# Altium schematic sheet betaV2.0.SchDoc
size A3; Organization: Altium Limited; Address1: L3, 12a Rodborough Rd; Address2: Frenchs Forest; Address3: NSW; Address4: Australia 2086
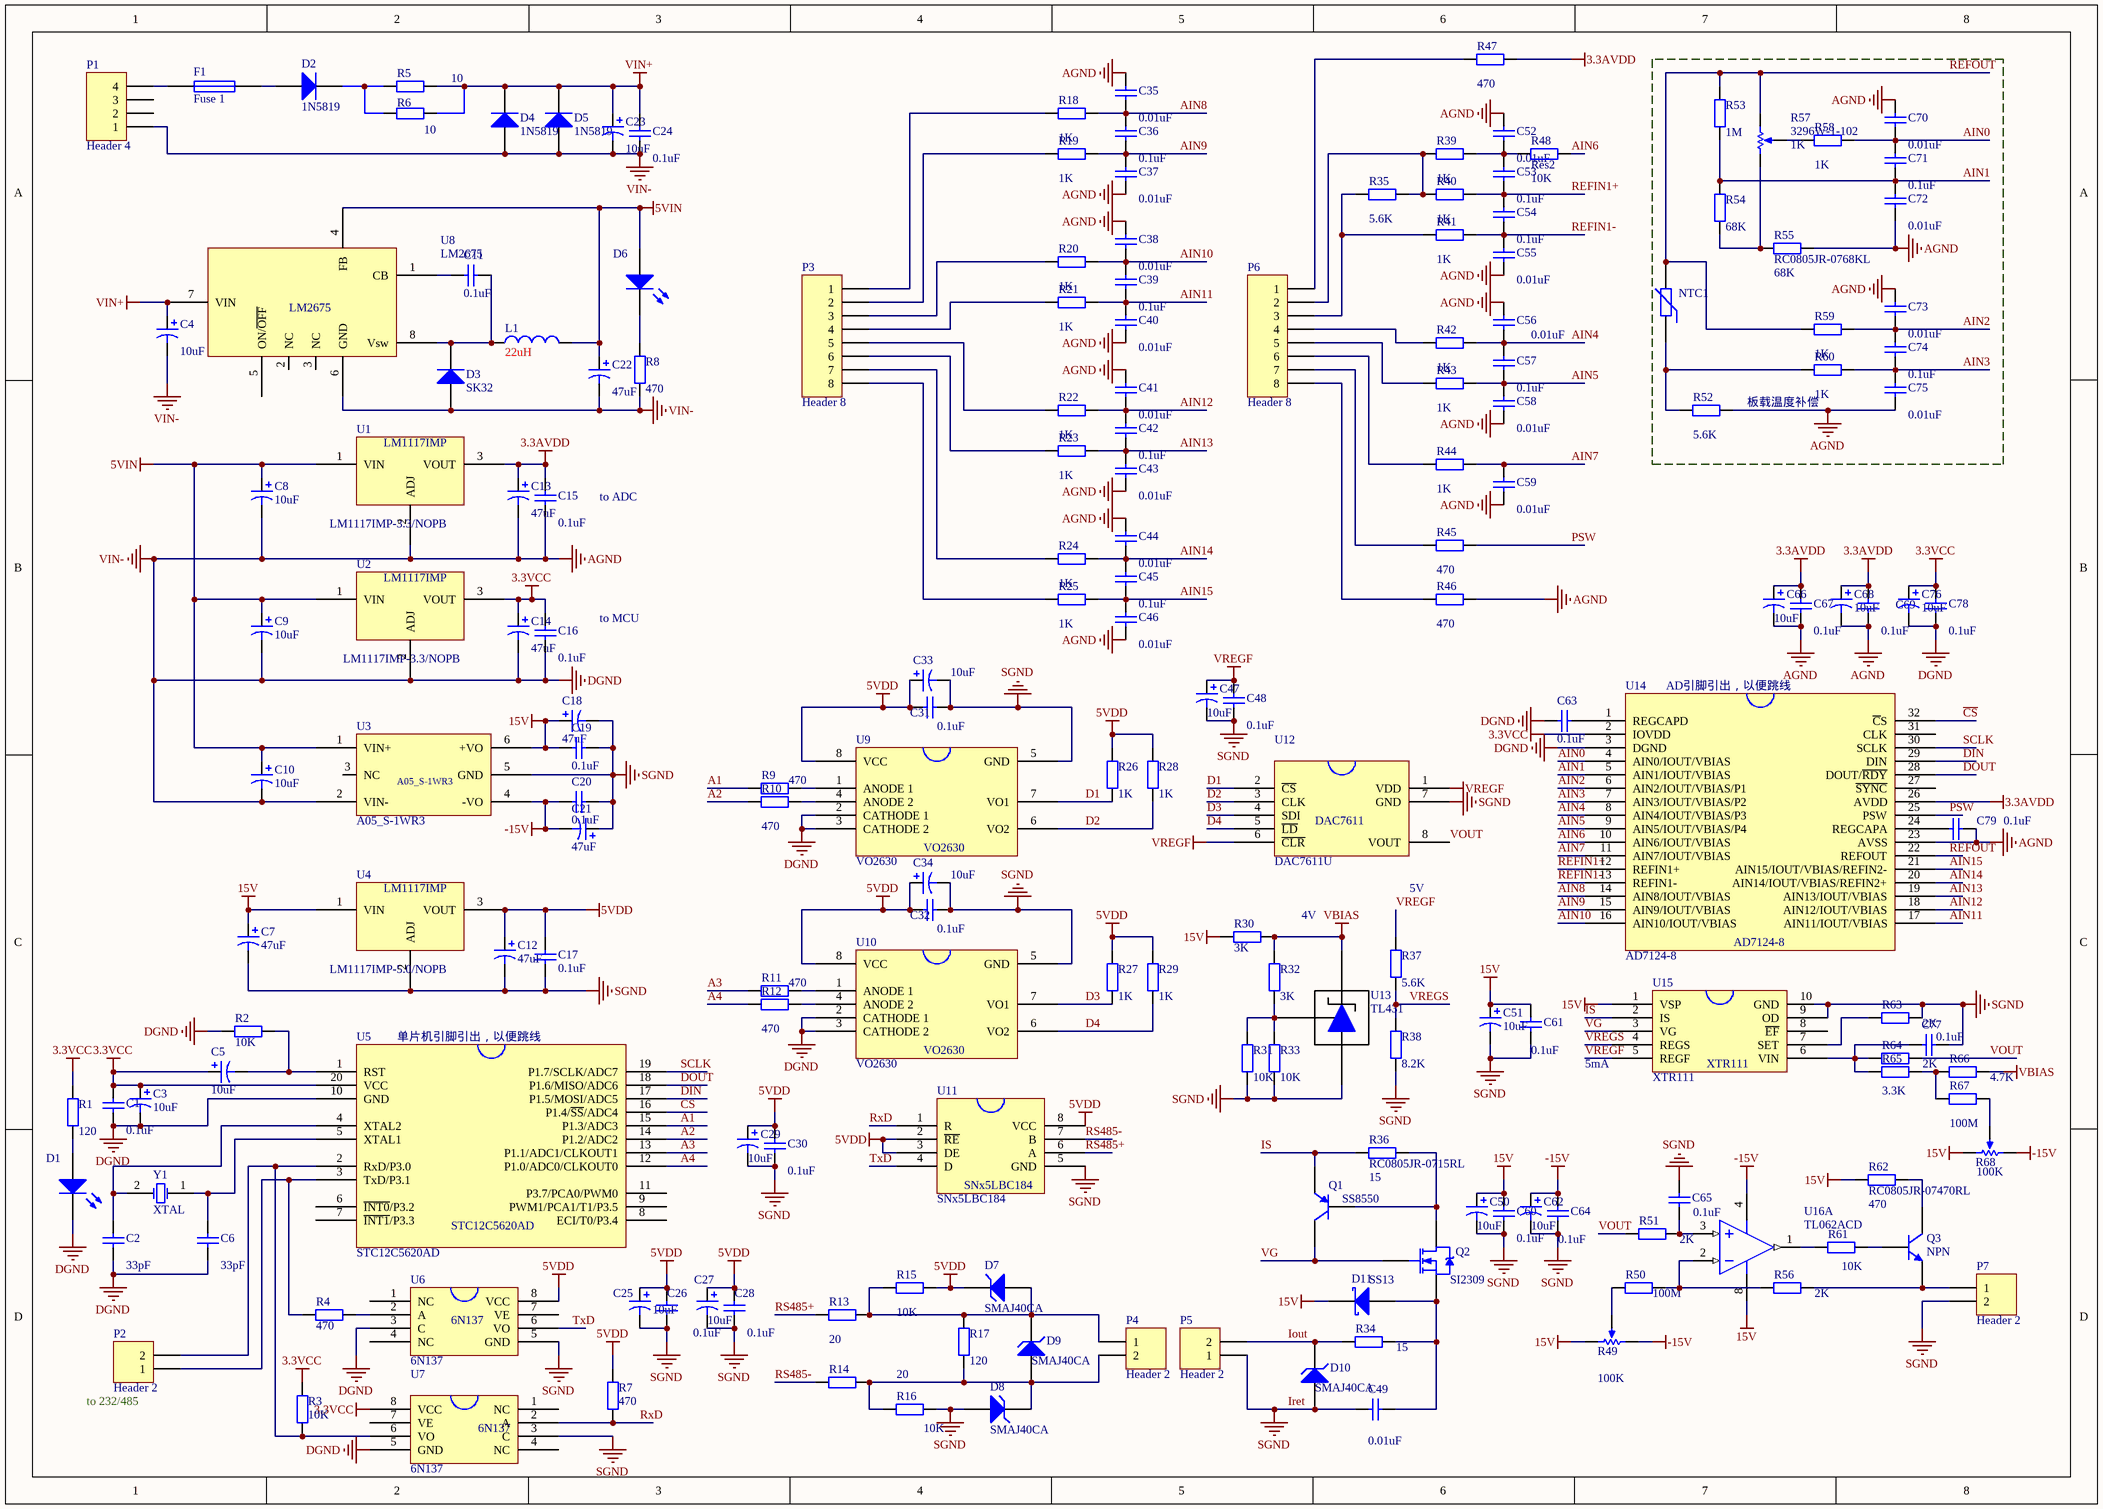
[diagram p0: betaV2.0.SchDoc]

## Parts
C1  value 0.1uF  [0805c]  (hidden comment: CC0805MRX7R9BB104)
C2  value 33pF  [0805c]  (hidden comment: CC0805MRX7R9BB330)
C3  value 10uF  [CB]  (hidden comment: T494B106M010AHAUTO)
C4  value 10uF  [Φ6.3×11.5]  (hidden comment: ECR1VNP100M1V050011)
C5  value 10uF  [CB]  (hidden comment: T494B106M010AHAUTO)
C6  value 33pF  [0805c]  (hidden comment: CC0805MRX7R9BB330)
C7  value 47uF  [CB]  (hidden comment: T494B476K025ATAUTO)
C8  value 10uF  [CB]  (hidden comment: T494B106M010AHAUTO)
C9  value 10uF  [CB]  (hidden comment: T494B106M010AHAUTO)
C10  value 10uF  [CB]  (hidden comment: T494B106M010AHAUTO)
C11  value 0.1uF  [0805c]  (hidden comment: CC0805MRX7R9BB104)
C12  value 47uF  [CB]  (hidden comment: T494B476M010AHAUTO)
C13  value 47uF  [CB]  (hidden comment: T494B476M010AHAUTO)
C14  value 47uF  [CB]  (hidden comment: T494B476M010AHAUTO)
C15  value 0.1uF  [0805c]  (hidden comment: CC0805MRX7R9BB104)
C16  value 0.1uF  [0805c]  (hidden comment: CC0805MRX7R9BB104)
C17  value 0.1uF  [0805c]  (hidden comment: CC0805MRX7R9BB104)
C18  value 47uF  [CB]  (hidden comment: T494B476K025ATAUTO)
C19  value 0.1uF  [0805c]  (hidden comment: CC0805MRX7R9BB104)
C20  value 0.1uF  [0805c]  (hidden comment: CC0805MRX7R9BB104)
C21  value 47uF  [CB]  (hidden comment: T494B476K025ATAUTO)
C22  value 47uF  [CB]  (hidden comment: T494B476M010AHAUTO)
C23  value 10uF  [Φ6.3×11.5]  (hidden comment: ECR1VNP100M1V050011)
C24  value 0.1uF  [0805c]  (hidden comment: CC0805MRX7R9BB104)
C25  value 10uF  [CB]  (hidden comment: T494B106M010AHAUTO)
C26  value 0.1uF  [0805c]  (hidden comment: CC0805MRX7R9BB104)
C27  value 10uF  [CB]  (hidden comment: T494B106M010AHAUTO)
C28  value 0.1uF  [0805c]  (hidden comment: CC0805MRX7R9BB104)
C29  value 10uF  [CB]  (hidden comment: T494B106M010AHAUTO)
C30  value 0.1uF  [0805c]  (hidden comment: CC0805MRX7R9BB104)
C31  value 0.1uF  [0805c]  (hidden comment: CC0805MRX7R9BB104)
C32  value 0.1uF  [0805c]  (hidden comment: CC0805MRX7R9BB104)
C33  value 10uF  [CB]  (hidden comment: T494B106M010AHAUTO)
C34  value 10uF  [CB]  (hidden comment: T494B106M010AHAUTO)
C35  value 0.01uF  [0805c]  (hidden comment: CC0805MRX7R9BB103)
C36  value 0.1uF  [0805c]  (hidden comment: CC0805MRX7R9BB104)
C37  value 0.01uF  [0805c]  (hidden comment: CC0805MRX7R9BB103)
C38  value 0.01uF  [0805c]  (hidden comment: CC0805MRX7R9BB103)
C39  value 0.1uF  [0805c]  (hidden comment: CC0805MRX7R9BB104)
C40  value 0.01uF  [0805c]  (hidden comment: CC0805MRX7R9BB103)
C41  value 0.01uF  [0805c]  (hidden comment: CC0805MRX7R9BB103)
C42  value 0.1uF  [0805c]  (hidden comment: CC0805MRX7R9BB104)
C43  value 0.01uF  [0805c]  (hidden comment: CC0805MRX7R9BB103)
C44  value 0.01uF  [0805c]  (hidden comment: CC0805MRX7R9BB103)
C45  value 0.1uF  [0805c]  (hidden comment: CC0805MRX7R9BB104)
C46  value 0.01uF  [0805c]  (hidden comment: CC0805MRX7R9BB103)
C47  value 10uF  [CB]  (hidden comment: T494B106M010AHAUTO)
C48  value 0.1uF  [0805c]  (hidden comment: CC0805MRX7R9BB104)
C49  value 0.01uF  [0805c]  (hidden comment: CC0805MRX7R9BB103)
C50  value 10uF  [CB]  (hidden comment: T494B106M025AHAUTO)
C51  value 10uF  [CB]  (hidden comment: T494B106M025AHAUTO)
C52  value 0.01uF  [0805c]  (hidden comment: CC0805MRX7R9BB103)
C53  value 0.1uF  [0805c]  (hidden comment: CC0805MRX7R9BB104)
C54  value 0.1uF  [0805c]  (hidden comment: CC0805MRX7R9BB104)
C55  value 0.01uF  [0805c]  (hidden comment: CC0805MRX7R9BB103)
C56  value 0.01uF  [0805c]  (hidden comment: CC0805MRX7R9BB103)
C57  value 0.1uF  [0805c]  (hidden comment: CC0805MRX7R9BB104)
C58  value 0.01uF  [0805c]  (hidden comment: CC0805MRX7R9BB103)
C59  value 0.01uF  [0805c]  (hidden comment: CC0805MRX7R9BB103)
C60  value 0.1uF  [0805c]  (hidden comment: CC0805MRX7R9BB104)
C61  value 0.1uF  [0805c]  (hidden comment: CC0805MRX7R9BB104)
C62  value 10uF  [CB]  (hidden comment: T494B106M025AHAUTO)
C63  value 0.1uF  [0805c]  (hidden comment: CC0805MRX7R9BB104)
C64  value 0.1uF  [0805c]  (hidden comment: CC0805MRX7R9BB104)
C65  value 0.1uF  [0805c]  (hidden comment: CC0805MRX7R9BB104)
C66  value 10uF  [CB]  (hidden comment: T494B106M010AHAUTO)
C67  value 0.1uF  [0805c]  (hidden comment: CC0805MRX7R9BB104)
C68  value 10uF  [CB]  (hidden comment: T494B106M010AHAUTO)
C69  value 0.1uF  [0805c]  (hidden comment: CC0805MRX7R9BB104)
C70  value 0.01uF  [0805c]  (hidden comment: CC0805MRX7R9BB103)
C71  value 0.1uF  [0805c]  (hidden comment: CC0805MRX7R9BB104)
C72  value 0.01uF  [0805c]  (hidden comment: CC0805MRX7R9BB103)
C73  value 0.01uF  [0805c]  (hidden comment: CC0805MRX7R9BB103)
C74  value 0.1uF  [0805c]  (hidden comment: CC0805MRX7R9BB104)
C75  value 0.01uF  [0805c]  (hidden comment: CC0805MRX7R9BB103)
C76  value 10uF  [CB]  (hidden comment: T494B106M010AHAUTO)
C77  value 0.1uF  [0805c]  (hidden comment: CC0805MRX7R9BB104)
C78  value 0.1uF  [0805c]  (hidden comment: CC0805MRX7R9BB104)
C79  value 0.1uF  [0805c]  (hidden comment: CC0805MRX7R9BB104)
D1  150080GS75000  [6-0805_N]  (value not drawn)
D2  1N5819  [SMC]
D3  SK32  [SMC]
D4  1N5819  [SMC]
D5  1N5819  [SMC]
D6  150080GS75000  [LEDΦ3.0]  (value not drawn)
D7  SMAJ40CA  [SMB]
D8  SMAJ40CA  [SMB]
D9  SMAJ40CA  [SMB]
D10  SMAJ40CA  [SMB]
D11  SS13  [SMB]
F1  Fuse 1  [6-0805_L]
L1  value 22uH  [vls4012]  (hidden comment: VLS4012HBX-220M)
NTC1  NTCS0805E3103JHT  [6-0805_N]  (value not drawn)
P1  Header 4  [HDR1X4]
P2  Header 2  [HDR1X2]
P3  Header 8  [HDR1X8]
P4  Header 2  [HDR1X2]
P5  Header 2  [HDR1X2]
P6  Header 8  [HDR1X8]
P7  Header 2  [HDR1X2]
Q1  SS8550  [SOT-23-BJT]
Q2  SI2309  [SOT-23-MOS]
Q3  NPN  [SOT-23-BJT]
R1  value 120  [0805R]  (hidden comment: RC0805JR-07120RL)
R2  value 10K  [0805R]  (hidden comment: RC0805JR-0710KL)
R3  value 10K  [0805R]  (hidden comment: RC0805JR-0710KRL)
R4  value 470  [0805R]  (hidden comment: RC0805JR-07470RL)
R5  value 10  [0805R]  (hidden comment: PNP-200KJBJ26-10R)
R6  value 10  [0805R]  (hidden comment: PNP-200KJBJ26-10R)
R7  value 470  [0805R]  (hidden comment: RC0805JR-07470RL)
R8  value 470  [0805R]  (hidden comment: RC0805JR-07470RL)
R9  value 470  [0805R]  (hidden comment: RC0805JR-07470RL)
R10  value 470  [0805R]  (hidden comment: RC0805JR-07470RL)
R11  value 470  [0805R]  (hidden comment: RC0805JR-07470RL)
R12  value 470  [0805R]  (hidden comment: RC0805JR-07470RL)
R13  value 20  [0805R]  (hidden comment: RC0805JR-0720RL)
R14  value 20  [0805R]  (hidden comment: RC0805JR-0720RL)
R15  value 10K  [0805R]  (hidden comment: RC0805JR-0710KL)
R16  value 10K  [0805R]  (hidden comment: RC0805JR-0710KL)
R17  value 120  [0805R]  (hidden comment: RC0805JR-07120RL)
R18  value 1K  [0805R]  (hidden comment: RC0805JR-071KL)
R19  value 1K  [0805R]  (hidden comment: RC0805JR-071KL)
R20  value 1K  [0805R]  (hidden comment: RC0805JR-071KL)
R21  value 1K  [0805R]  (hidden comment: RC0805JR-071KL)
R22  value 1K  [0805R]  (hidden comment: RC0805JR-071KL)
R23  value 1K  [0805R]  (hidden comment: RC0805JR-071KL)
R24  value 1K  [0805R]  (hidden comment: RC0805JR-071KL)
R25  value 1K  [0805R]  (hidden comment: RC0805JR-071KL)
R26  value 1K  [0805R]  (hidden comment: RC0805JR-071KL)
R27  value 1K  [0805R]  (hidden comment: RC0805JR-071KL)
R28  value 1K  [0805R]  (hidden comment: RC0805JR-071KL)
R29  value 1K  [0805R]  (hidden comment: RC0805JR-071KL)
R30  value 3K  [0805R]  (hidden comment: RC0805JR-073KL)
R31  value 10K  [0805R]  (hidden comment: RC0805JR-0710KL)
R32  value 3K  [0805R]  (hidden comment: RC0805JR-073KL)
R33  value 10K  [0805R]  (hidden comment: RC0805JR-0710KL)
R34  value 15  [0805R]  (hidden comment: RC0805JR-0715RL)
R35  value 5.6K  [0805R]  (hidden comment: RC0805JR-075600RL)
R36  RC0805JR-0715RL  value 15  [0805R]
R37  value 5.6K  [0805R]  (hidden comment: RC0805JR-075600RL)
R38  value 8.2K  [0805R]  (hidden comment: RC0805JR-078200RL)
R39  value 1K  [0805R]  (hidden comment: RC0805JR-071KL)
R40  value 1K  [0805R]  (hidden comment: RC0805JR-071KL)
R41  value 1K  [0805R]  (hidden comment: RC0805JR-071KL)
R42  value 1K  [0805R]  (hidden comment: RC0805JR-071KL)
R43  value 1K  [0805R]  (hidden comment: RC0805JR-071KL)
R44  value 1K  [0805R]  (hidden comment: RC0805JR-071KL)
R45  value 470  [0805R]  (hidden comment: RC0805JR-07470RL)
R46  value 470  [0805R]  (hidden comment: RC0805JR-07470RL)
R47  value 470  [0805R]  (hidden comment: RC0805JR-07470RL)
R48  Res2  value 10K  [0805R]
R49  value 100K  [VR5]  (hidden comment: 3296W-1-104)
R50  value 100M  [0805R]  (hidden comment: RC0805JR-07100ML)
R51  value 2K  [0805R]  (hidden comment: RC0805JR-072KL)
R52  value 5.6K  [0805R]  (hidden comment: RC0805JR-075600RL)
R53  value 1M  [0805R]  (hidden comment: RC0805JR-071000KL)
R54  value 68K  [0805R]  (hidden comment: RC0805JR-0768KL)
R55  RC0805JR-0768KL  value 68K  [0805R]
R56  value 2K  [0805R]  (hidden comment: RC0805JR-072KL)
R57  3296W-1-102  value 1K  [VR5]
R58  value 1K  [0805R]  (hidden comment: RC0805JR-071KL)
R59  value 1K  [0805R]  (hidden comment: RC0805JR-071KL)
R60  value 1K  [0805R]  (hidden comment: RC0805JR-071KL)
R61  value 10K  [0805R]  (hidden comment: RC0805JR-0710KL)
R62  RC0805JR-07470RL  value 470  [0805R]
R63  value 2K  [0805R]  (hidden comment: RC0805JR-072KL)
R64  value 2K  [0805R]  (hidden comment: RC0805JR-072KL)
R65  value 3.3K  [0805R]  (hidden comment: RC0805JR-073300RL)
R66  value 4.7K  [0805R]  (hidden comment: RC0805JR-074700RL)
R67  value 100M  [0805R]  (hidden comment: RC0805JR-07100ML)
R68  value 100K  [VR5]  (hidden comment: 3296W-1-104)
U1  LM1117IMP-3.3/NOPB  [SOT223_N]
U2  LM1117IMP-3.3/NOPB  [SOT223_N]
U3  A05_S-1WR3  [A05_S-1WR3]
U4  LM1117IMP-5.0/NOPB  [SOT223_N]
U5  STC12C5620AD  [SOP20]
U6  6N137  [SO8_N]
U7  6N137  [SO8_N]
U8  LM2675  [TI-D8_N]
U9  VO2630  [SO8_N]
U10  VO2630  [SO8_N]
U11  SNx5LBC184  [SO8_N]
U12  DAC7611U  [TI-D8_N]
U13  TL431  [SOT-23-3]
U14  AD7124-8  [TI-RHB32-3150X3150TP_V]
U15  XTR111  [S-PDSO-G10]
U16  TL062ACD  [TI-D8_N]  (part A of 2)
Y1  XTAL  [11.0592MHz]

## Blocks framed on the sheet
板载温度补偿: C70-C75 NTC1 R52-R55 R57-R60

## Nets
3.3AVDD: C13.1 C15.1 C66.1 C67.1 C68.1 C69.1 R47.1 U1.3(VOUT) U14.26(AVDD)
3.3VCC: C1.1 C3.1 C5.1 C14.1 C16.1 C76.1 C78.1 R1.1 R3.2 U2.3(VOUT) U5.20(VCC) U7.8(VCC) U14.2(IOVDD)
5VDD: C12.1 C17.2 C25.1 C26.1 C27.1 C28.1 C29.1 C30.1 C31.1 C32.1 C33.1 C34.1 D7.2(K) R7.2 R15.1 R26.1 R27.1 R28.1 R29.1 U4.3(VOUT) U6.8(VCC) U9.8(VCC) U10.8(VCC) U11.2(~{RE}) U11.3(DE) U11.8(VCC)
5VIN: C8.1 C9.1 C10.1 C22.1 D6.1(A) L1.2 U1.1(VIN) U2.1(VIN) U3.1(VIN+) U8.4(FB)
15V: C7.1 C18.1 C19.1 C50.1 C51.1 C60.2 C61.2 D11.2(K) R30.1 R49.2(BOT) R62.1 R68.2(BOT) U3.6(+VO) U4.1(VIN) U15.1(VSP) U16.8(VCC+)
-15V: C20.1 C21.2 C62.1 C64.2 R49.1(TOP) R68.1(TOP) U3.4(-VO) U16.4(VCC-)
AGND: C1.2 C2.2 C3.2 C4.2 C6.2 C8.2 C9.2 C10.2 C13.2 C14.2 C15.2 C16.2 C22.2 C23.2 C24.2 C35.2 C37.2 C38.2 C40.2 C41.2 C43.2 C44.2 C46.2 C52.2 C55.2 C56.2 C58.2 C59.2 C63.1 C66.2 C67.2 C68.2 C69.2 C70.2 C72.2 C73.2 C75.2 C76.2 C78.2 C79.1 D1.2(K) D3.1(A) D4.1(A) D5.1(A) P1.1 R2.1 R8.1 R46.1 R52.1 R55.1 U1.2(ADJ) U2.2(ADJ) U3.2(VIN-) U5.10(GND) U6.3(C) U7.5(GND) U8.6(GND) U9.2(CATHODE_1) U9.3(CATHODE_2) U10.2(CATHODE_1) U10.3(CATHODE_2) U14.3(DGND) U14.23(AVSS)  [also labelled DGND, VIN-]
Iret: C7.2 C12.2 C17.1 C18.2 C19.2 C20.2 C21.1 C25.2 C26.2 C27.2 C28.2 C29.2 C30.2 C31.2 C32.2 C33.2 C34.2 C47.2 C48.1 C49.2 C50.2 C51.2 C60.1 C61.1 C62.2 C64.1 C65.2 C77.1 D8.1(A) D10.1(A) P5.1 P7.2 R16.1 R31.2 R33.2 R38.2 R63.1 U3.5(GND) U4.2(ADJ) U6.5(GND) U7.3(C) U9.5(GND) U10.5(GND) U11.5(GND) U12.7(GND) U13.3(ANODE) U15.9(OD) U15.10(GND)  [also labelled SGND]
VBIAS: R30.2 R32.1 R66.1 U13.1(CATHODE)
VIN+: C4.1 C23.1 C24.1 D4.2(K) D5.2(K) R5.1 R6.1 U8.7(VIN)
VREGF: C47.1 C48.2 R37.1 U12.1(VDD) U12.6(~{CLR}) U15.5(REGF)
A1: R9.2 U5.15(P1.3/ADC3)
A2: R10.2 U5.14(P1.2/ADC2)
A3: R11.2 U5.13(P1.1/ADC1/CLKOUT1)
A4: R12.2 U5.12(P1.0/ADC0/CLKOUT0)
AIN0: C70.1 C71.1 R58.1 U14.4(AIN0/IOUT/VBIAS)
AIN1: C71.2 C72.1 R53.2 R54.1 U14.5(AIN1/IOUT/VBIAS)
AIN2: C73.1 C74.1 R59.1 U14.6(AIN2/IOUT/VBIAS/P1)
AIN3: C74.2 C75.1 R60.1 U14.7(AIN3/IOUT/VBIAS/P2)
AIN4: C56.1 C57.1 R42.1 U14.8(AIN4/IOUT/VBIAS/P3)
AIN5: C57.2 C58.1 R43.1 U14.9(AIN5/IOUT/VBIAS/P4)
AIN6: R48.1 U14.10(AIN6/IOUT/VBIAS)
AIN7: C59.1 R44.1 U14.11(AIN7/IOUT/VBIAS)
AIN8: C35.1 C36.1 R18.1 U14.14(AIN8/IOUT/VBIAS)
AIN9: C36.2 C37.1 R19.1 U14.15(AIN9/IOUT/VBIAS)
AIN10: C38.1 C39.1 R20.1 U14.16(AIN10/IOUT/VBIAS)
AIN11: C39.2 C40.1 R21.1 U14.17(AIN11/IOUT/VBIAS)
AIN12: C41.1 C42.1 R22.1 U14.18(AIN12/IOUT/VBIAS)
AIN13: C42.2 C43.1 R23.1 U14.19(AIN13/IOUT/VBIAS)
AIN14: C44.1 C45.1 R24.1 U14.20(AIN14/IOUT/VBIAS/REFIN2+)
AIN15: C45.2 C46.1 R25.1 U14.21(AIN15/IOUT/VBIAS/REFIN2-)
~{CS}: U5.16(P1.4/~{SS}/ADC4) U14.32(~{C}S)
D1: R26.2 U9.7(VO1) U12.2(~{CS})
D2: R28.2 U9.6(VO2) U12.3(CLK)
D3: R27.2 U10.7(VO1) U12.4(SDI)
D4: R29.2 U10.6(VO2) U12.5(~{LD})
DIN: U5.17(P1.5/MOSI/ADC5) U14.29(DIN)
DOUT: U5.18(P1.6/MISO/ADC6) U14.28(DOUT/~{RDY})
Iout: D10.2(K) P5.2 R34.1
IS: Q1.3(E) R36.2 U15.2(IS)
PSW: R45.1 U14.25(PSW)
REFIN1+: C53.1 C54.1 R40.1 U14.12(REFIN1+)
REFIN1-: C54.2 C55.1 R41.1 U14.13(REFIN1-)
REFOUT: NTC1.2 R53.1 R57.2(BOT) R59.2 U14.22(REFOUT)
RS485+: R13.1 U11.6(A)
RS485-: R14.2 U11.7(B)
RxD: R7.1 U7.2(A) U11.1(R)
SCLK: U5.19(P1.7/SCLK/ADC7) U14.30(SCLK)
TxD: U6.6(VO) U11.4(D)
VG: Q1.1(C) Q2.1(G) U15.3(VG)
VOUT: R51.2 R64.1 U12.8(VOUT)
VREGS: R37.2 R38.1 U15.4(REGS)
NetC2_1: C2.1 U5.4(XTAL2) Y1.2(OSC2)
NetC5_2: C5.2 R2.2 U5.1(RST)
NetC6_1: C6.1 U5.5(XTAL1) Y1.1(OSC1)
NetC11_1: C11.1 U8.1(CB)
NetC11_2: C11.2 D3.2(K) L1.1 U8.8(Vsw)
NetC49_1: C49.1 D11.1(A) Q2.3(S) R34.2
NetC52_1: C52.1 C53.2 R39.1 R48.2
NetC63_2: C63.2 U14.1(REGCAPD)
NetC65_1: C65.1 R51.1 U16.3(IN1+)
NetC77_2: C77.2 R64.2 R65.2 U15.6(VIN)
NetC79_2: C79.2 U14.24(REGCAPA)
NetD1_1: D1.1(A) R1.2
NetD2_1: D2.1(A) F1.2
NetD2_2: D2.2(K) R5.2 R6.2
NetD6_2: D6.2(K) R8.2
NetD7_1: D7.1(A) D9.2(K) P4.1 R13.2 R15.2 R17.2
NetD8_2: D8.2(K) D9.1(A) P4.2 R14.1 R16.2 R17.1
NetF1_1: F1.1 P1.4
NetNTC1_1: NTC1.1 R52.2 R60.2
NetP2_1: P2.1 R4.1 U5.3(TxD/P3.1)
NetP2_2: P2.2 R3.1 U5.2(RxD/P3.0) U7.6(VO)
NetP3_1: P3.1 R18.2
NetP3_2: P3.2 R19.2
NetP3_3: P3.3 R20.2
NetP3_4: P3.4 R21.2
NetP3_5: P3.5 R22.2
NetP3_6: P3.6 R23.2
NetP3_7: P3.7 R24.2
NetP3_8: P3.8 R25.2
NetP6_1: P6.1 R47.2
NetP6_2: P6.2 R35.2 R39.2 R40.2
NetP6_3: P6.3 R35.1 R41.2
NetP6_4: P6.4 R42.2
NetP6_5: P6.5 R43.2
NetP6_6: P6.6 R44.2
NetP6_7: P6.7 R45.2
NetP6_8: P6.8 R46.2
NetP7_1: P7.1 Q3.3(E) R56.1
NetQ1_2: Q1.2(B) Q2.2(D) R36.1
NetQ3_1: Q3.1(C) R62.2
NetQ3_2: Q3.2(B) R61.1
NetR4_2: R4.2 U6.2(A)
NetR9_1: R9.1 U9.1(ANODE_1)
NetR10_1: R10.1 U9.4(ANODE_2)
NetR11_1: R11.1 U10.1(ANODE_1)
NetR12_1: R12.1 U10.4(ANODE_2)
NetR31_1: R31.1 R32.2 R33.1 U13.2(REF)
NetR49_3: R49.3(TAP) R50.2
NetR50_1: R50.1 R56.2 U16.2(IN1-)
NetR54_2: R54.2 R55.2 R57.1(TOP)
NetR57_3: R57.3(TAP) R58.2
NetR61_2: R61.2 U16.1(OUT1)
NetR63_2: R63.2 U15.7(SET)
NetR65_1: R65.1 R66.2 R67.1
NetR67_2: R67.2 R68.3(TAP)

Not connected (* = marked no-connect by the designer): P1 2 3; U3 3(NC); U5 6(~{INT0}/P3.2) 7(~{INT1}/P3.3) 8(ECI/T0/P3.4) 9(PWM1/PCA1/T1/P3.5) 11(P3.7/PCA0/PWM0); U6 1(NC) 4(NC) 7(VE); U7 1(NC) 4(NC) 7(VE); U8 2(NC) 3(NC) 5(ON/~{OFF}); U14 27(~{SYNC}) 31(CLK); U15 8(~{EF})

## Notes on the sheet
- to ADC
- to MCU
- (near U14) AD引脚引出，以便跳线
- 4V
- 5V
- (near U5) 单片机引脚引出，以便跳线
- 5mA
- (near P2) to 232/485
- Title
- Size:
- Date:
- A3
- Number:
- Time:
- Revision:
- Sheet
- of
- File:

## Library data of the parts
C1 C2 C6 C11 C15-C17 C19 C20 C24 C26 C28 C30-C32 C35-C46 C48 C49 C52-C61 C63-C65 C67 C69-C75 C77-C79 = Cap: Capacitor
  C2 C6 C11 C15-C17 C19 C20 C24 C26 C28 C30-C32 C35-C46 C48 C49 C52-C61 C63-C65 C67 C69-C75 C77-C79: Published: 8-Jun-2000; LatestRevisionDate: 17-Jul-2002; LatestRevisionNote: Re-released for DXP Platform.; PackageReference: RAD-0.3; Publisher: Altium Limited; PackageDescription: Radial Cap, Thru-Hole; 2 Leads; 0.3 in Pin Spacing
C3-C5 C7-C10 C12-C14 C18 C21-C23 C25 C27 C29 C33 C34 C47 C50 C51 C62 C66 C68 C76 = Cap Pol1: Polarized Capacitor (Radial); Published: 8-Jun-2000; LatestRevisionDate: 17-Jul-2002; LatestRevisionNote: Re-released for DXP Platform.; PackageReference: RB7.6-15; Publisher: Altium Limited; PackageDescription: Polarized Capacitor (Radial); 2 Leads
D1 D6 = LED2: Typical RED, GREEN, YELLOW, AMBER GaAs LED; Published: 8-Jun-2000; LatestRevisionDate: 17-Jul-2002; LatestRevisionNote: Re-released for DXP Platform.; PackageVersion: Feb-2002; PackageReference: 3.2X1.6X1.1; Publisher: Altium Limited; PackageDescription: SM LED; 2 Flat Leads
D2-D5 = Diode: Default Diode; Published: 8-Jun-2000; LatestRevisionDate: 17-Jul-2002; LatestRevisionNote: Re-released for DXP Platform.; PackageVersion: Sep-1996; PackageReference: SMC; Publisher: Altium Limited; PackageDescription: DO-214-AB/SMC; 2 C-Bend Leads; Body 7.9 x 5.9 mm, inc. leads (LxW); Code_JEDEC: DO-214-AB
D7-D10 = D Zener: Zener Diode; Published: 8-Jun-2000; LatestRevisionDate: 17-Jul-2002; LatestRevisionNote: Re-released for DXP Platform.; PackageReference: DIODE-0.7; Publisher: Altium Limited; PackageDescription: Diode, Thru-Hole; 2 Leads; 0.7 in Pin Spacing
D11 = D Schottky: Schottky Diode; Published: 8-Jun-2000; LatestRevisionDate: 17-Jul-2002; LatestRevisionNote: Re-released for DXP Platform.; PackageReference: SMB; Publisher: Altium Limited; PackageDescription: DO-214-AA/SMB; 2 C-Bend Leads; Body 5.3 x 3.6 mm, inc. leads (LxW); Code_JEDEC: DO-214-AA
F1 = Fuse 1: Fuse; Published: 8-Jun-2000; LatestRevisionDate: 17-Jul-2002; LatestRevisionNote: Re-released for DXP Platform.; PackageReference: PIN-W2/E2.8; Publisher: Altium Limited; PackageDescription: Thru-Hole; 2 Leads
L1 = Inductor
NTC1 = Res Varistor: Varistor (Voltage-Sensitive Resistor); Published: 24-Mar-1999; LatestRevisionDate: 29-May-2009; LatestRevisionNote: IPC-7351 Footprint Added.; PackageVersion: Mar-2003; PackageReference: 6-0805; Publisher: Altium Limited; PackageDescription: Chip Resistor 0805 Case Size; Code_IPC: RESC2012
P1 = Header 4: Header, 4-Pin; LatestRevisionDate: 17-Jul-2002; LatestRevisionNote: Re-released for DXP Platform.; Publisher: Altium Limited
P2 P4 P5 P7 = Header 2: Header, 2-Pin; LatestRevisionDate: 17-Jul-2002; LatestRevisionNote: Re-released for DXP Platform.; Publisher: Altium Limited
P3 P6 = Header 8: Header, 8-Pin; LatestRevisionDate: 17-Jul-2002; LatestRevisionNote: Re-released for DXP Platform.; Publisher: Altium Limited
Q1 = PNP: PNP Bipolar Transistor; Published: 8-Jun-2000; LatestRevisionDate: 29-May-2009; LatestRevisionNote: IPC-7351 Footprint Added.; PackageVersion: Aug-1999; PackageReference: SOT-23B; Publisher: Altium Limited; PackageDescription: 3-Pin SOT-23 Package 0.95 mm Pitch, 2.4 mm Lead Span
Q2 = NMOS-2: N-Channel Power MOSFET; Note: Pin 2 is electrically connected to pin 4.; Published: 8-Jun-2000; LatestRevisionDate: 17-Jul-2002; LatestRevisionNote: Re-released for DXP Platform.; DatasheetVersion: PD-9.814; PackageVersion: Feb-1997; PackageReference: TO-220AB; Publisher: Altium Limited; PackageDescription: TO, Thru-Hole, Vertical, Heatsink Mounted; 3 In-Line Leads; Pitch 2.54 mm; ComponentLink1Description: Manufacturer Link; ComponentLink1URL: http://www.irf.com/
Q3 = NPN: NPN Bipolar Transistor; Published: 8-Jun-2000; LatestRevisionDate: 17-Jul-2002; LatestRevisionNote: Re-released for DXP Platform.; PackageReference: TO-226-AA; Publisher: Altium Limited; PackageDescription: TO, Flat Index; 3 In-Line, Axial Leads; Body Dia. 4.8mm; Leads 0.55 x 0.51 mm (max); Code_JEDEC: TO-226-AA
R1-R48 R50-R56 R58-R67 = Res2: Resistor; Published: 8-Jun-2000; LatestRevisionDate: 17-Jul-2002; LatestRevisionNote: Re-released for DXP Platform.; PackageReference: AXIAL-0.4; Publisher: Altium Limited; PackageDescription: Axial Device, Thru-Hole; 2 Leads; 0.4 in Pin Spacing
R49 R57 R68 = RPot: Potentiometer; Sim Note: Enter the Resistance value and the set point into parameter fields.; Set Position: 0.5; Published: 8-Jun-2000; LatestRevisionDate: 17-Jul-2002; LatestRevisionNote: Re-released for DXP Platform.; PackageReference: VR5; Publisher: Altium Limited; PackageDescription: Variable Resistor, Thru-Hole; 3 Leads
U1 U2 U4 = LM1117IMP
U12 = DAC7611
U16 = TL062ACD: Low-Power JFET-Input Operational Amplifier, 7 to 36 V, 0 to 70 degC, 8-pin SOIC (D8), Green (RoHS & no Sb/Br); Manufacturer: Texas Instruments; CMRR(Min)(dB): 80; GBW(Typ)(MHz): 1; IIB(Max)(pA): 200; Iq per channel(Max)(mA): 0.25; Number of Channels: 2; Offset Drift(Typ)(uV/C): 10; Rating: Catalog; Slew Rate(Typ)(V/us): 3.5; Sub Family: General Purpose Amplifier, High Supply Voltage Amplifier (>=30V), Low Power Amp (<=500uA); Total Supply Voltage(Max)(+5V is 5, +/-5V is 10): 36; Total Supply Voltage(Min)(+5V is 5, +/-5V is 10): 7; Vio (25C)(Max)(mV): 6; Vn at 1kHz(Typ)(nV/rtHz): 42; DatasheetVersion: SLOS078J; PackageVersion: 4040047-3/M, 06/2011; PackageReference: D8; PackageDescription: 8-Pin Plastic Small Outline, Body 4.9 x 3.9 mm, Pitch 1.27 mm; Supplier 1: Digi-Key; Supplier Part Number 1: 296-7175-5-ND; Supplier 2: Farnell; Supplier Part Number 2: 9593241; Supplier 3: Newark; Supplier Part Number 3: 08F9224; Supplier 4: Mouser; Supplier Part Number 4: 595-TL062ACD; Eco-Plan: Green (RoHS & no Sb/Br); Mounting Technology: Surface Mount; Code_JEDEC: MS-012; PartNumber: TL062ACD; ComponentLink1Description: Manufacturer URL; ComponentLink1URL: http://www.ti.com/; ComponentLink2Description: Datasheet; ComponentLink2URL: http://www.ti.com/lit/ds/symlink/tl062a.pdf; ComponentLink3Description: Package Specification; ComponentLink3URL: http://www.ti.com/litv/pdf/msoi002j
Y1 = XTAL: Crystal Oscillator; Published: 8-Jun-2000; LatestRevisionDate: 17-Jul-2002; LatestRevisionNote: Re-released for DXP Platform.; PackageReference: R38; Publisher: Altium Limited; PackageDescription: Crystal, Thru-Hole; 2 Leads; Body 3.1 x 8.2 mm (Dia.xH)